# Altium schematic sheet Ideal_Diode.SchDoc
size 297 x 209 mm; SheetNumber: 3; SheetTotal: 11
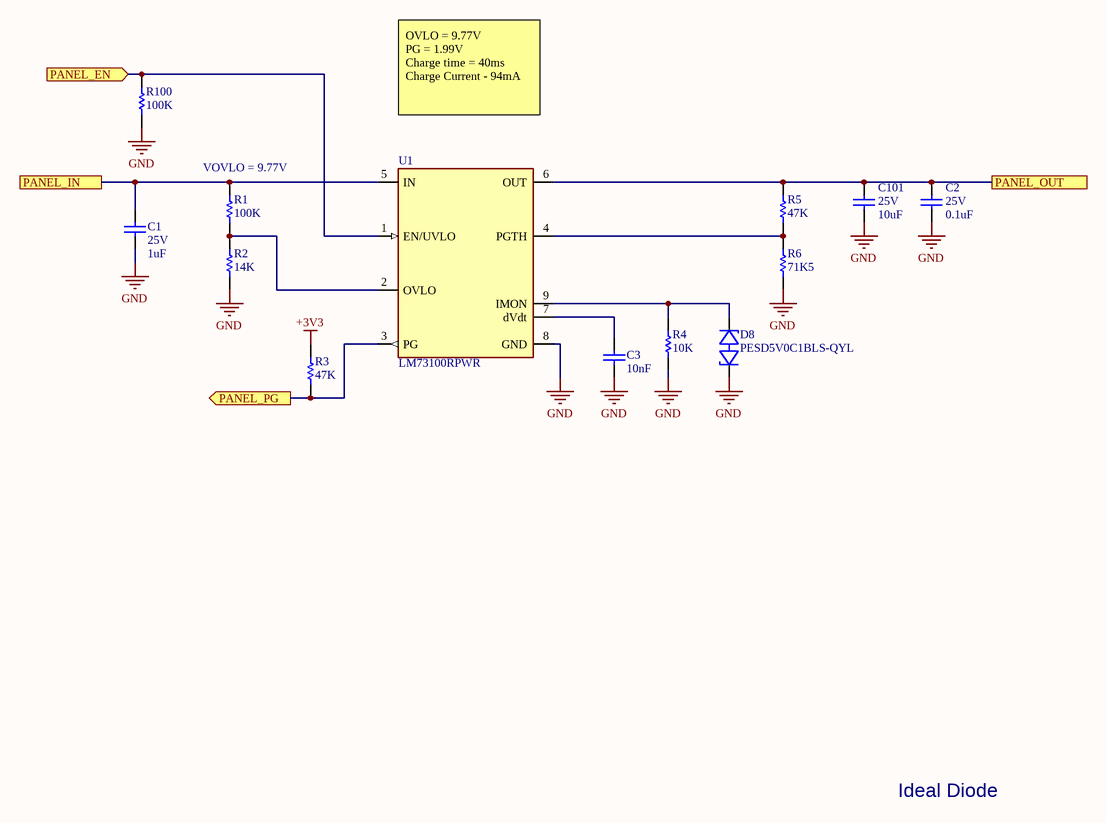
[diagram p0: Ideal_Diode.SchDoc]

## Parts
C1  Voltage Rating: 25V  Capacitance: 1uF  [CAPC0805X060]  (hidden comment: CL21B105KAFNNNE)
C2  Voltage Rating: 25V  Capacitance: 0.1uF  [CAPC0805X060]  (hidden comment: CL21B104KACNNNC)
C3  Capacitance: 10nF  [CAPC0805X060]  (hidden comment: CL21B103KBANNNC)
C101  Voltage Rating: 25V  Capacitance: 10uF  [CAPC0805X060]  (hidden comment: GRM21BZ71E106KE15L)
D8  PESD5V0C1BLS-QYL  [PESD5V0C1BLS-Q]
R1  Resistance: 100K  [RESC0805]  (hidden comment: RMCF0805FG100K)
R2  Resistance: 14K  [RESC0805]  (hidden comment: RMCF0805FT14K0)
R3  Resistance: 47K  [RESC0805]  (hidden comment: RMCF0805FT47K0)
R4  Resistance: 10K  [RESC0805]  (hidden comment: RMCF0805FT10K0)
R5  Resistance: 47K  [RESC0805]  (hidden comment: RMCF0805FT47K0)
R6  Resistance: 71K5  [RESC0805]  (hidden comment: RMCF0805FT71K5)
R100  Resistance: 100K  [RESC0805]  (hidden comment: RMCF0805FG100K)
U1  LM73100RPWR  [VFQFN-10]

## Ports
PANEL_EN (in, see PDM[2B]), PANEL_IN (see PDM[2B]), PANEL_OUT (see PDM[1B]), PANEL_PG (out, see PDM[2B])

## Nets
+3V3: R3.2
GND: C1.1 C2.1 C3.1 C101.1 D8.1 R2.1 R4.1 R6.1 R100.1 U1.8(GND)
PANEL_EN: R100.2 U1.1(EN/UVLO) ; port PANEL_EN
PANEL_IN: C1.2 R1.2 U1.5(IN) ; port PANEL_IN
PANEL_OUT: C2.2 C101.2 R5.2 U1.6(OUT) ; port PANEL_OUT
PANEL_PG: R3.1 U1.3(PG) ; port PANEL_PG
NetC3_2: C3.2 U1.7(dVdt)
NetD8_2: D8.2 R4.2 U1.9(IMON)
NetR1_1: R1.1 R2.2 U1.2(OVLO)
NetR5_1: R5.1 R6.2 U1.4(PGTH)

## Notes on the sheet
- OVLO = 9.77V
  PG = 1.99V
  Charge time = 40ms
  Charge Current - 94mA
- (near R1) VOVLO = 9.77V
- Ideal Diode
- Size:
- Title:
- A4
- Project:
- Rev:
- Date:
- Drawn By:
- Sheet:
- of

## Library data of the parts
C1 = CL21B105KAFNNNE: 1uF ±10% 25V Ceramic Capacitor X7R 0805 (2012 Metric); Part Number: CL21B105KAFNNNE; Distributor Part Number: 1276-1066-1-ND; Tolerance: 10%; Case Code: 0805; Distributor: Digikey
C2 = CL21B104KACNNNC: 0.1uF ±10% 25V Ceramic Capacitor X7R 0805 (2012 Metric); Part Number: CL21B104KACNNNC; Distributor Part Number: 1276-1099-1-ND; Tolerance: 10%; Case Code: 0805; Distributor: Digikey
C3 = CL21B103KBANNNC: 10nF ±10% 50V Ceramic Capacitor X7R 0805 (2012 Metric); Voltage Rating: 25V; Part Number: CL21B103KBANNNC; Distributor Part Number: 1276-1015-1-ND; Tolerance: 10%; Case Code: 0805; Distributor: Digikey
C101 = GRM21BZ71E106KE15L: 10uF ±10% 25V Ceramic Capacitor X7R 0805 (2012 Metric); Manufacturer Part Number: GRM21BZ71E106KE15L; Distributor Part Number: 490-GRM21BZ71E106KE15LCT-ND; Tolerance: 10%; Case Code: 0805; Distributor: Digikey
D8 = PESD5V0C1BLS-QYL: 5.4V (Typ) Clamp 6.5A (8/20µs) Ipp Tvs Diode Surface Mount DFN1006BD-2; Voltage - Reverse Standoff (Typ): 5V (Max); Voltage - Breakdown (Min): 7.5V; Part Number: PESD5V0C1BLS-QYL; Voltage - Clamping (Max) @ Ipp: 5.4V (Typ); Operating Temperature: -55C ~ 150C; ComponentLink1Description: Datasheet; ComponentLink1URL: https://assets.nexperia.com/documents/data-sheet/PESD5V0C1BLS-Q.pdf; Distributor: Digikey; Distributor Part Number: 1727-PESD5V0C1BLS-QYLCT-ND
R1 R100 = RMCF0805FG100K: 100 kOhms ±1% 0.125W, 1/8W Chip Resistor 0805 (2012 Metric) Automotive AEC-Q200 Thick Film; Part Number: RMCF0805FG100K; Tolerance: 1%; Distributor Part Number: RMCF0805FG100KCT-ND; Distributor: Digikey; Case Code: 0805
R2 = RMCF0805FT14K0: 14 kOhms ±1% 0.125W, 1/8W Chip Resistor 0805 (2012 Metric) Automotive AEC-Q200 Thick Film; Part Number: RMCF0805FT14K0; Tolerance: 1%; Distributor Part Number: RMCF0805FT14K0CT-ND; Distributor: Digikey; Case Code: 0805
R3 R5 = RMCF0805FT47K0: 47 kOhms ±1% 0.125W, 1/8W Chip Resistor 0805 (2012 Metric) Automotive AEC-Q200 Thick Film; Part Number: RMCF0805FT47K0; Tolerance: 1%; Distributor Part Number: RMCF0805FT47K0CT-ND; Distributor: Digikey; Case Code: 0805
R4 = RMCF0805FT10K0: 10 kOhms ±1% 0.125W, 1/8W Chip Resistor 0805 (2012 Metric) Automotive AEC-Q200 Thick Film; Part Number: RMCF0805FT10K0; Tolerance: 1%; Distributor Part Number: RMCF0805FT10K0CT-ND; Distributor: Digikey; Case Code: 0805
R6 = RMCF0805FT71K5: 71.5 kOhms ±1% 0.125W, 1/8W Chip Resistor 0805 (2012 Metric) Automotive AEC-Q200 Thick Film; Part Number: RMCF0805FT71K5; Tolerance: 1%; Distributor Part Number: RMCF0805FT71K5CT-ND; Distributor: Digikey; Case Code: 0805
U1 = LM73100RPWR: Ideal Diode 2.7 - 23 V, 5.5 A with Input Reverse Polarity and / Overvoltage Protection; Current Output: 5.5A; Voltage Supply: 2.7V ~ 23V; Part Number: LM73100RPWR; Distributor Part Number: 296-LM73100RPWRCT-ND; Distributor: Digikey; Operating Temperature: -40°C ~ 125°C (TJ)